# Altium schematic sheet SensorControl.SchDoc
size A4
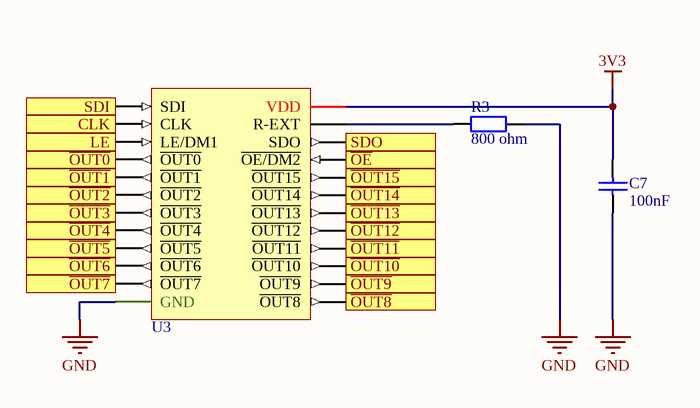
[diagram p0: SensorControl.SchDoc]

## Parts
C7  100nF  [FP_0805_CAP_085]
R3  Resistance: 800 ohm  [0805-W]  (hidden comment: CRCW0805806RFKEA)
U3  STP16CP05TTR  [24-Pin TSSOP]  (value not drawn)

## Ports
CLK (in), LE (in), SDI (in), SDO (out), ~{OE} (in), ~{OUT0} (out), ~{OUT1} (out), ~{OUT2} (out), ~{OUT3} (out), ~{OUT4} (out), ~{OUT5} (out), ~{OUT6} (out), ~{OUT7} (out), ~{OUT8} (out), ~{OUT9} (out), ~{OUT10} (out), ~{OUT11} (out), ~{OUT12} (out), ~{OUT13} (out), ~{OUT14} (out), ~{OUT15} (out)

## Nets
3V3: C7.2 U3.24(VDD)
GND: C7.1 R3.2 U3.1(GND)
CLK: U3.3(CLK) ; port CLK
LE: U3.4(LE/DM1) ; port LE
~{OE}: U3.21(~{OE/DM2}) ; port ~{OE}
~{OUT0}: U3.5(~{OUT0}) ; port ~{OUT0}
~{OUT1}: U3.6(~{OUT1}) ; port ~{OUT1}
~{OUT10}: U3.15(~{OUT10}) ; port ~{OUT10}
~{OUT11}: U3.16(~{OUT11}) ; port ~{OUT11}
~{OUT12}: U3.17(~{OUT12}) ; port ~{OUT12}
~{OUT13}: U3.18(~{OUT13}) ; port ~{OUT13}
~{OUT14}: U3.19(~{OUT14}) ; port ~{OUT14}
~{OUT15}: U3.20(~{OUT15}) ; port ~{OUT15}
~{OUT2}: U3.7(~{OUT2}) ; port ~{OUT2}
~{OUT3}: U3.8(~{OUT3}) ; port ~{OUT3}
~{OUT4}: U3.9(~{OUT4}) ; port ~{OUT4}
~{OUT5}: U3.10(~{OUT5}) ; port ~{OUT5}
~{OUT6}: U3.11(~{OUT6}) ; port ~{OUT6}
~{OUT7}: U3.12(~{OUT7}) ; port ~{OUT7}
~{OUT8}: U3.13(~{OUT8}) ; port ~{OUT8}
~{OUT9}: U3.14(~{OUT9}) ; port ~{OUT9}
SDI: U3.2(SDI) ; port SDI
SDO: U3.22(SDO) ; port SDO
NetR3_1: R3.1 U3.23(R-EXT)

## Library data of the parts
C7 = CAP 100nF: Capacitor; Tolerance: +80%/-20%; Voltage: 25V; Reference: 1759167; Name: SMD Multilayer Ceramic Capacitor, 0805; Supplier: Farnell; Value: 100nF
R3 = CRCW0805806RFKEA: RES, THICK FILM, 806R, 1%, 0.125W, 0805
U3 = STP16CP05TTR: Led Driver, 16 Outputs, Constant Current, 3V-5.5V in, 30MHz switch, 20V/100mA out, TSSOP-24